# EAGLE design M7050C (EAGLE 6.6.0)
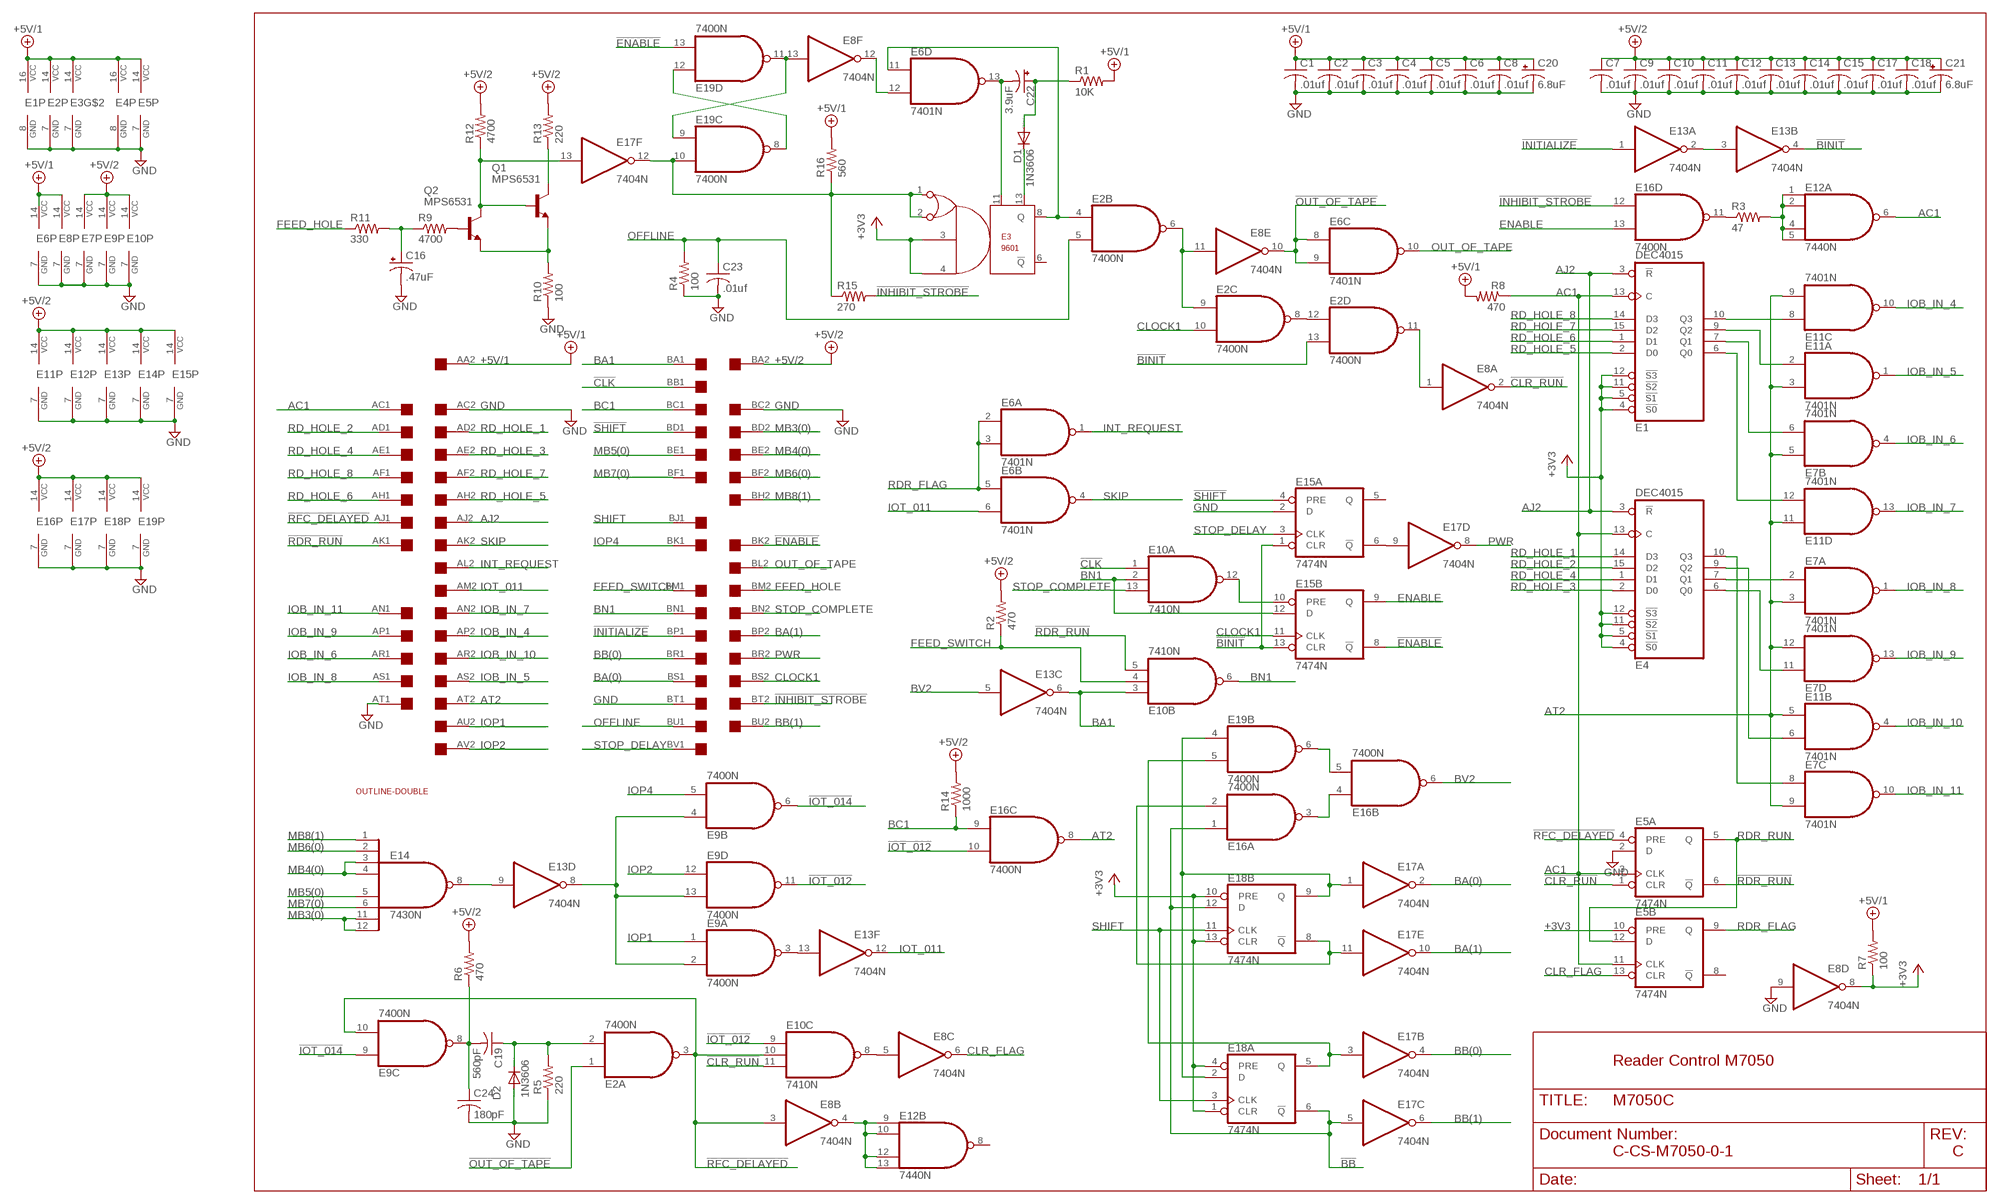
[diagram p0: schematic, sheet 1]

## Parts
C1  .01uf  C-US075-032X103  [C075-032X103]
C2  .01uf  C-US075-032X103  [C075-032X103]
C3  .01uf  C-US075-032X103  [C075-032X103]
C4  .01uf  C-US075-032X103  [C075-032X103]
C5  .01uf  C-US075-032X103  [C075-032X103]
C6  .01uf  C-US075-032X103  [C075-032X103]
C7  .01uf  C-US075-032X103  [C075-032X103]
C8  .01uf  C-US075-032X103  [C075-032X103]
C9  .01uf  C-US075-032X103  [C075-032X103]
C10  .01uf  C-US075-032X103  [C075-032X103]
C11  .01uf  C-US075-032X103  [C075-032X103]
C12  .01uf  C-US075-032X103  [C075-032X103]
C13  .01uf  C-US075-032X103  [C075-032X103]
C14  .01uf  C-US075-032X103  [C075-032X103]
C15  .01uf  C-US075-032X103  [C075-032X103]
C16  .47uF  CPOL-USE15-5AXIAL  [E15-5]
C17  .01uf  C-US075-032X103  [C075-032X103]
C18  .01uf  C-US075-032X103  [C075-032X103]
C19  560pF  C-US075-032X103  [C075-032X103]
C20  6.8uF  CPOL-USE20-8AXIAL  [E12-8]
C21  6.8uF  CPOL-USE20-8AXIAL  [E12-8]
C22  3.9uF  CPOL-USE15-5AXIAL  [E15-5]
C23  .01uf  C-US075-032X103  [C075-032X103]
C24  180pF  C-US075-032X103  [C075-032X103]
D1  1N3606  1N4148DO35-10  [DO35-10]
D2  1N3606  1N4148DO35-10  [DO35-10]
E1  DEC4015  [DIL16]
E2  7400N  [DIL14]
E3  9601  [DIL14]
E4  DEC4015  [DIL16]
E5  7474N  74S74N  [DIL14]
E6  7401N  74LS01N  [DIL14]
E7  7401N  74LS01N  [DIL14]
E8  7404N  [DIL14]
E9  7400N  [DIL14]
E10  7410N  [DIL14]
E11  7401N  74LS01N  [DIL14]
E12  7440N  74S20N  [DIL14]
E13  7404N  [DIL14]
E14  7430N  [DIL14]
E15  7474N  74S74N  [DIL14]
E16  7400N  [DIL14]
E17  7404N  [DIL14]
E18  7474N  74S74N  [DIL14]
E19  7400N  [DIL14]
Q1  MPS6531  2N2102  [TO5]
Q2  MPS6531  2N2102  [TO5]
R1  10K  R-US_0207/10  [0207/10]
R2  470  R-US_0207/10  [0207/10]
R3  47  R-US_0207/10  [0207/10]
R4  100  R-US_0207/10  [0207/10]
R5  220  R-US_0207/10  [0207/10]
R6  470  R-US_0207/10  [0207/10]
R7  100  R-US_0207/10  [0207/10]
R8  470  R-US_0207/10  [0207/10]
R9  4700  R-US_0207/10  [0207/10]
R10  100  R-US_0207/10  [0207/10]
R11  330  R-US_0207/10  [0207/10]
R12  4700  R-US_0207/10  [0207/10]
R13  220  R-US_0207/10  [0207/10]
R14  1000  R-US_0207/10  [0207/10]
R15  270  R-US_0207/10  [0207/10]
R16  560  R-US_0207/10  [0207/10]
U$5  DOUBLE  [EDGE-CON4]
U$6  OUTLINE-DOUBLE  [DOUBLE]

## Nets
!BA: E16.2(A:I1) E17.11(E:I) E18.8(B:!Q)
!BB: E16.1(A:I0) E17.5(C:I) E18.6(A:!Q) E18.12(B:D)
!BINIT: E2.13(D:I1) E13.4(B:O) E15.1(A:CLR) E15.13(B:CLR)
!CLK: E10.1(A:I0) U$5.BB1
!CLR_RUN: E5.1(A:CLR) E8.2(A:O) E10.11(C:I2)
!ENABLE: E15.8(B:!Q) E19.13(D:I1) U$5.BK2
!INHIBIT_STROBE: E16.12(D:I0) R15.2 U$5.BT2
!INITIALIZE: E13.1(A:I) U$5.BP1
!IOT_011: E9.3(A:O) E13.13(F:I)
!IOT_012: E9.11(D:O) E10.9(C:I0) E16.10(C:I1)
!IOT_014: E9.6(B:O) E9.9(C:I0)
!OUT_OF_TAPE: E2.1(A:I0) E6.8(C:I0) E6.9(C:I1) E8.10(E:O)
!RDR_RUN: E5.6(A:!Q) E10.5(B:I2) U$5.AK1
!RFC_DELAYED: E2.3(A:O) E5.4(A:PRE) E8.3(B:I) E9.10(C:I1) E10.10(C:I1) U$5.AJ1
!SHIFT: E15.4(A:PRE) U$5.BD1
+3V3: E1.4(!S0) E1.5(!S1) E1.11(!S2) E1.12(!S3) E3.3 E3.4 E4.4(!S0) E4.5(!S1) E4.11(!S2) E4.12(!S3) E5.10(B:PRE) E8.8(D:O) E18.1(A:CLR) E18.4(A:PRE) E18.10(B:PRE) E18.13(B:CLR) R7.1
+5V/1 [Supply]: C1.1 C2.1 C3.1 C4.1 C5.1 C6.1 C8.1 C20.+ E1.16(VCC) E2.14(P:VCC) E3.14(VCC) E4.16(VCC) E5.14(P:VCC) E6.14(P:VCC) E8.14(P:VCC) R1.2 R7.2 R8.2 R16.2 U$5.AA2
+5V/2 [Supply]: C7.1 C9.1 C10.1 C11.1 C12.1 C13.1 C14.1 C15.1 C17.1 C18.1 C21.+ E7.14(P:VCC) E9.14(P:VCC) E10.14(P:VCC) E11.14(P:VCC) E12.14(P:VCC) E13.14(P:VCC) E14.14(VCC) E15.14(P:VCC) E16.14(P:VCC) E17.14(P:VCC) E18.14(P:VCC) E19.14(P:VCC) R2.2 R6.2 R12.2 R13.2 R14.2 U$5.BA2
AC1: E1.13(C) E4.13(C) E5.3(A:CLK) E5.11(B:CLK) E12.6(A:O) R8.1 U$5.AC1
AJ2: E1.3(!R) E4.3(!R) U$5.AJ2
AT2: E7.3(A:I1) E7.5(B:I0) E7.9(C:I1) E7.12(D:I1) E11.3(A:I1) E11.5(B:I0) E11.9(C:I1) E11.11(D:I0) E16.8(C:O) U$5.AT2
BA: E17.1(A:I) E18.2(A:D) E18.9(B:Q) E19.4(B:I0)
BA1: E10.3(B:I0) E13.6(C:O) U$5.BA1
BA(0): E17.2(A:O) U$5.BS1
BA(1): E17.10(E:O) U$5.BP2
BB: E17.3(B:I) E18.5(A:Q) E19.5(B:I1)
BB(0): E17.4(B:O) U$5.BR1
BB(1): E17.6(C:O) U$5.BU2
BC1: E16.9(C:I0) R14.1 U$5.BC1
BN1: E10.2(A:I1) E10.6(B:O) E15.12(B:D) U$5.BN1
BV2: E13.5(C:I) E16.6(B:O)
CLOCK1: E2.10(C:I1) E15.11(B:CLK) U$5.BS2
CLR_FLAG: E5.13(B:CLR) E8.6(C:O)
ENABLE: E15.9(B:Q) E16.13(D:I1)
FEED_HOLE: R11.1 U$5.BM2
FEED_SWITCH: E10.4(B:I1) R2.1 U$5.BM1
GND [Supply]: C1.2 C2.2 C3.2 C4.2 C5.2 C6.2 C7.2 C8.2 C9.2 C10.2 C11.2 C12.2 C13.2 C14.2 C15.2 C16.- C17.2 C18.2 C20.- C21.- C23.2 C24.2 D2.A E1.8(GND) E2.7(P:GND) E3.7(GND) E4.8(GND) E5.2(A:D) E5.7(P:GND) E6.7(P:GND) E7.7(P:GND) E8.7(P:GND) E8.9(D:I) E9.7(P:GND) E10.7(P:GND) E11.7(P:GND) E12.7(P:GND) E13.7(P:GND) E14.7(GND) E15.2(A:D) E15.7(P:GND) E16.7(P:GND) E17.7(P:GND) E18.7(P:GND) E19.7(P:GND) R4.1 R5.1 R10.1 U$5.AC2 U$5.AT1 U$5.BC2 U$5.BT1
INT_REQUEST: E6.1(A:O) U$5.AL2
IOB_IN_4: E11.10(C:O) U$5.AP2
IOB_IN_5: E11.1(A:O) U$5.AS2
IOB_IN_6: E7.4(B:O) U$5.AR1
IOB_IN_7: E11.13(D:O) U$5.AN2
IOB_IN_8: E7.1(A:O) U$5.AS1
IOB_IN_9: E7.13(D:O) U$5.AP1
IOB_IN_10: E11.4(B:O) U$5.AR2
IOB_IN_11: E7.10(C:O) U$5.AN1
IOP1: E9.1(A:I0) U$5.AU2
IOP2: E9.12(D:I0) U$5.AV2
IOP4: E9.5(B:I1) U$5.BK1
IOT_011: E6.6(B:I1) E13.12(F:O) U$5.AM2
MB3(0): E14.11(I6) E14.12(I7) U$5.BD2
MB4(0): E14.3(I2) E14.4(I3) U$5.BE2
MB5(0): E14.5(I4) U$5.BE1
MB6(0): E14.2(I1) U$5.BF2
MB7(0): E14.6(I5) U$5.BF1
MB8(1): E14.1(I0) U$5.BH2
N$1: D1.C E3.13
N$2: E1.10(Q3) E11.8(C:I0)
N$3: E1.9(Q2) E11.2(A:I0)
N$4: C22.+ D1.A R1.1
N$5: E13.9(D:I) E14.8(O)
N$6: E2.11(D:O) E8.1(A:I)
N$8: E9.2(A:I1) E9.4(B:I0) E9.13(D:I1) E13.8(D:O)
N$9: E1.7(Q1) E7.6(B:I1)
N$10: E1.6(Q0) E11.12(D:I1)
N$11: E4.7(Q1) E7.2(A:I0)
N$12: E4.6(Q0) E7.11(D:I0)
N$13: E4.9(Q2) E11.6(B:I1)
N$14: E4.10(Q3) E7.8(C:I0)
N$16: E2.8(C:O) E2.12(D:I0)
N$17: E17.13(F:I) Q1.2(B) Q2.3(C) R12.1
N$18: Q1.3(C) R13.1
N$19: Q1.1(E) Q2.1(E) R10.2
N$20: Q2.2(B) R9.2
N$21: E3.1 E3.2 E17.12(F:O) E19.10(C:I1) R15.1 R16.1
N$22: C16.+ R9.1 R11.2
N$24: E16.5(B:I1) E19.6(B:O)
N$25: E16.3(A:O) E16.4(B:I0)
N$26: E16.11(D:O) R3.1
N$27: E15.6(A:!Q) E17.9(D:I)
N$28: E10.12(A:O) E15.10(B:PRE)
N$29: C19.2 C24.1 E9.8(C:O) R6.1
N$30: C19.1 D2.C E2.2(A:I1) R5.2
N$32: E13.2(A:O) E13.3(B:I)
N$33: E8.5(C:I) E10.8(C:O)
N$34: E2.4(B:I0) E3.8(Q) E6.11(D:I0)
N$35: E2.6(B:O) E2.9(C:I0) E8.11(E:I)
N$36: E8.4(B:O) E12.9(B:I0) E12.10(B:I1) E12.12(B:I2) E12.13(B:I3)
N$37: C22.- E3.11 E6.13(D:O)
N$38: E6.12(D:I1) E8.12(F:O)
N$39: E12.1(A:I0) E12.2(A:I1) E12.4(A:I2) E12.5(A:I3) R3.2
N$40: E8.13(F:I) E19.9(C:I0) E19.11(D:O)
N$41: E19.8(C:O) E19.12(D:I0)
OFFLINE: C23.1 E2.5(B:I1) R4.2 U$5.BU1
OUT_OF_TAPE: E6.10(C:O) U$5.BL2
PWR: E17.8(D:O) U$5.BR2
RD_HOLE_1: E4.14(D3) U$5.AD2
RD_HOLE_2: E4.15(D2) U$5.AD1
RD_HOLE_3: E4.2(D0) U$5.AE2
RD_HOLE_4: E4.1(D1) U$5.AE1
RD_HOLE_5: E1.2(D0) U$5.AH2
RD_HOLE_6: E1.1(D1) U$5.AH1
RD_HOLE_7: E1.15(D2) U$5.AF2
RD_HOLE_8: E1.14(D3) U$5.AF1
RDR_FLAG: E5.9(B:Q) E6.2(A:I0) E6.3(A:I1) E6.5(B:I0)
RDR_RUN: E5.5(A:Q) E5.12(B:D)
SHIFT: E18.3(A:CLK) E18.11(B:CLK) U$5.BJ1
SKIP: E6.4(B:O) U$5.AK2
STOP_COMPLETE: E10.13(A:I2) U$5.BN2
STOP_DELAY: E15.3(A:CLK) U$5.BV1
Unconnected: E3.6(!Q) E5.8(B:!Q) E12.8(B:O) E13.10(E:O) E13.11(E:I) E15.5(A:Q) E19.1(A:I0) E19.2(A:I1) E19.3(A:O) U$5.AA1 U$5.AB1 U$5.AB2 U$5.AL1 U$5.AM1 U$5.AU1 U$5.AV1 U$5.BB2 U$5.BH1 U$5.BJ2 U$5.BL1 U$5.BV2

## Notes on the sheet
- Reader Control M7050
- C-CS-M7050-0-1 | C

## Library data of the parts
C1-C15 C17-C19 C23 C24 = rcl:C-US: CAPACITOR, American symbol
C16 = dec-con:CPOL-USE15-5AXIAL: 0.5" veresion of an electrolytic
C20 C21 = dec-con:CPOL-USE20-8AXIAL: A 0.8 inch electrolytic.
C22 = rcl:CPOL-US: POLARIZED CAPACITOR, American symbol
D1 D2 = diode:1N4148: DIODE high speed (Philips)
E1 E4 = dec-con:DEC4015: Quad latch, used in early DEC boards.
E2 E9 E16 E19 = 74xx-us:74*00: Quad 2-input NAND gate
E3 = dec-con:9601: DEC9601 monstable
E5 E15 E18 = 74xx-us:74*74: Dual D type positive edge triggered FLIP FLOP, preset and clear
E6 E7 E11 = 74xx-us:74*01: Quad 2-input NAND gate, open collector
E8 E13 E17 = 74xx-us:74*04: Hex INVERTER
E10 = 74xx-us:74*10: Triple 3-input NAND gate
E12 = 74xx-us:74*20: Dual 4-input NAND gate
E14 = 74xx-us:74*30: 8-input NAND gate
Q1 Q2 = transistor-npn:2N2102: NPN Transistor
R1-R16 = rcl:R-US_: RESISTOR, American symbol
U$5 = dec-con:DOUBLE: Double-Height DEC board
U$6 = dec-con:OUTLINE-*: Board outlines for DEC boards.

## Net classes
1 Supply: width 0.813 mm

## Board
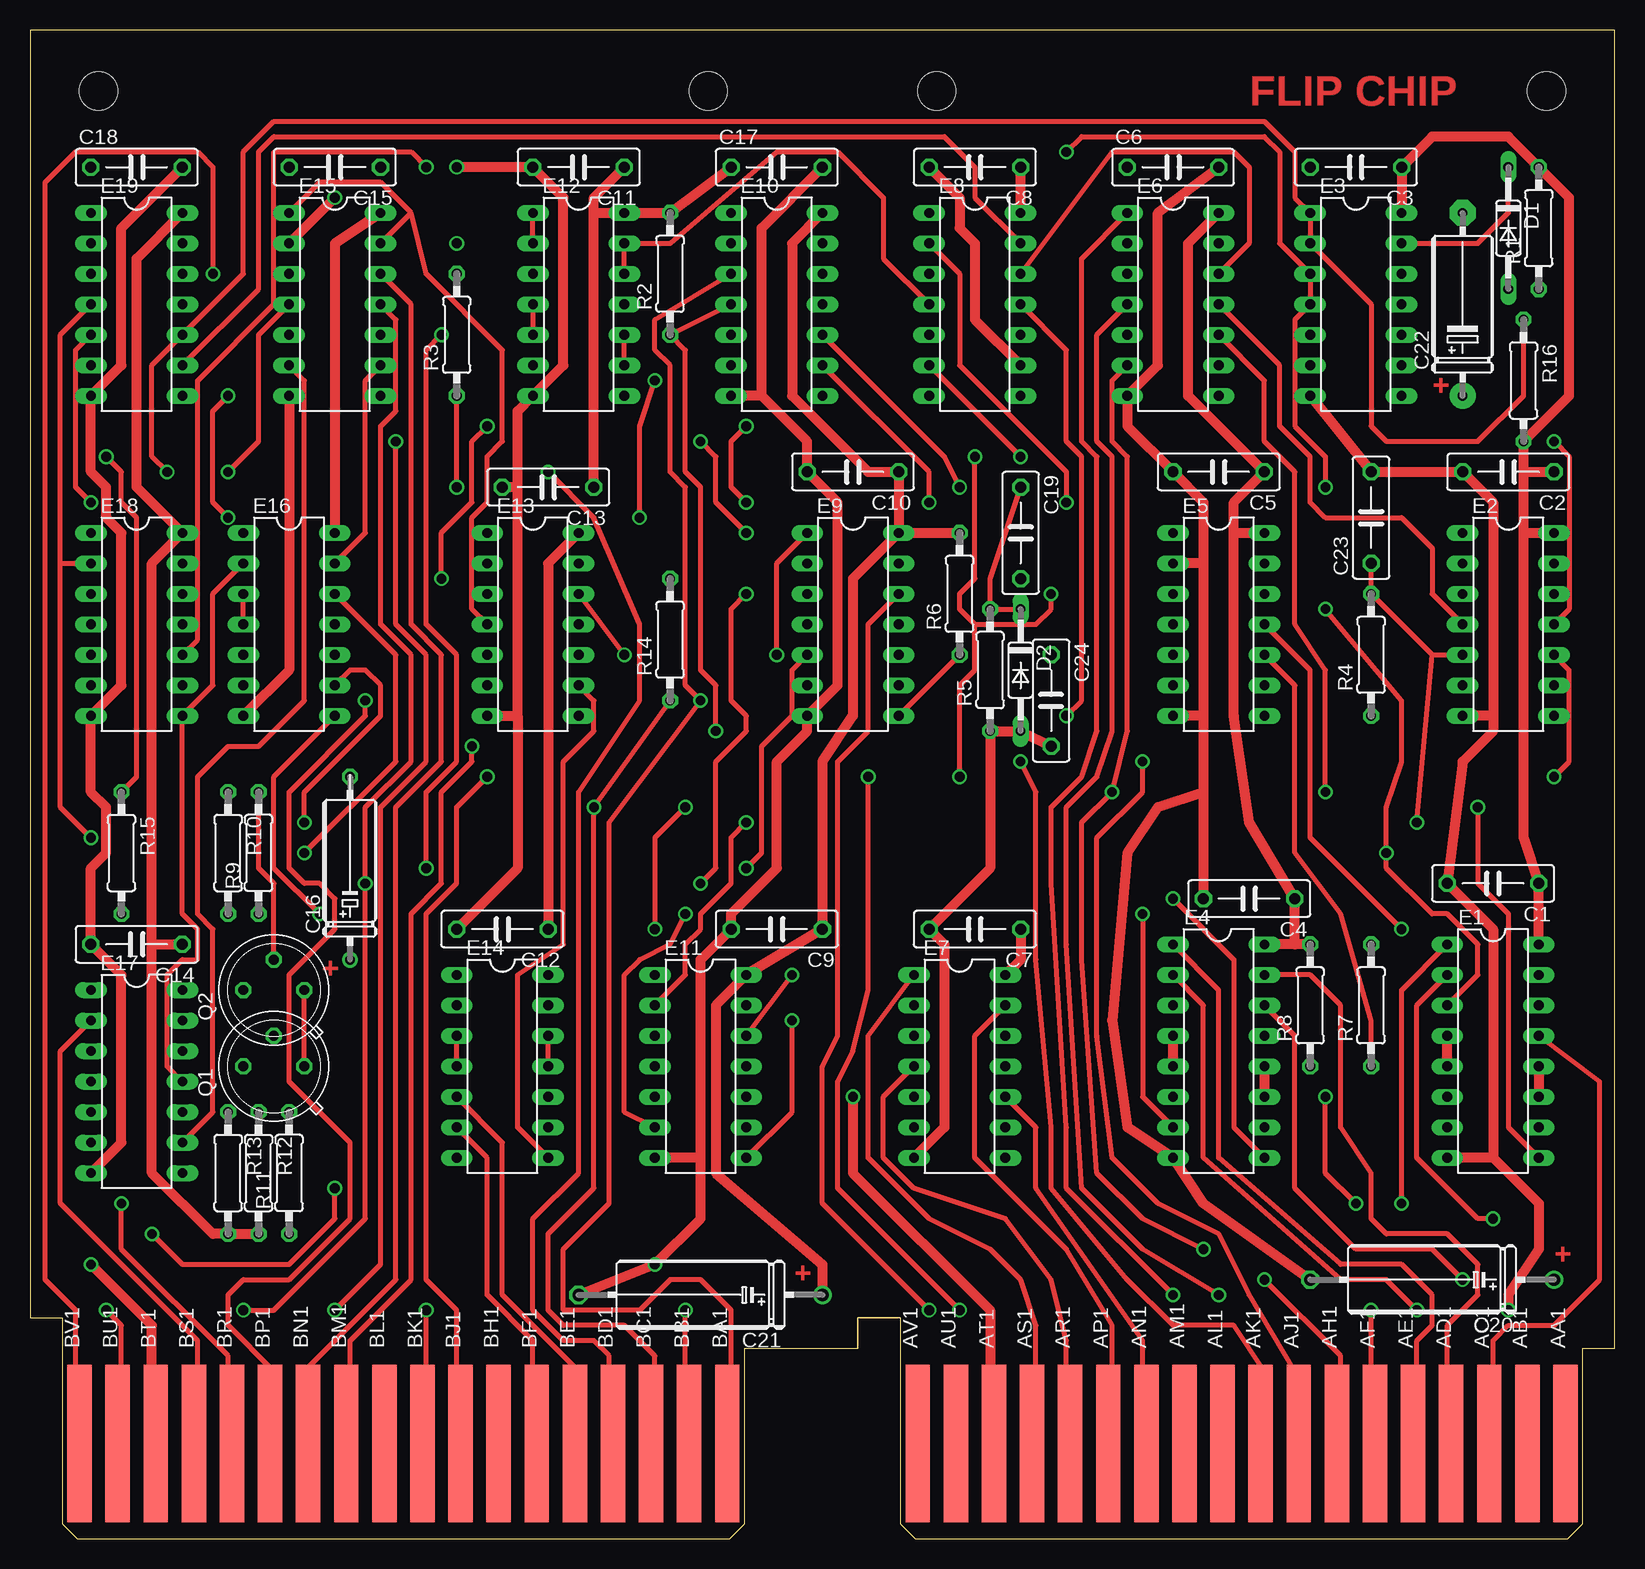
[diagram p1: board, top side]
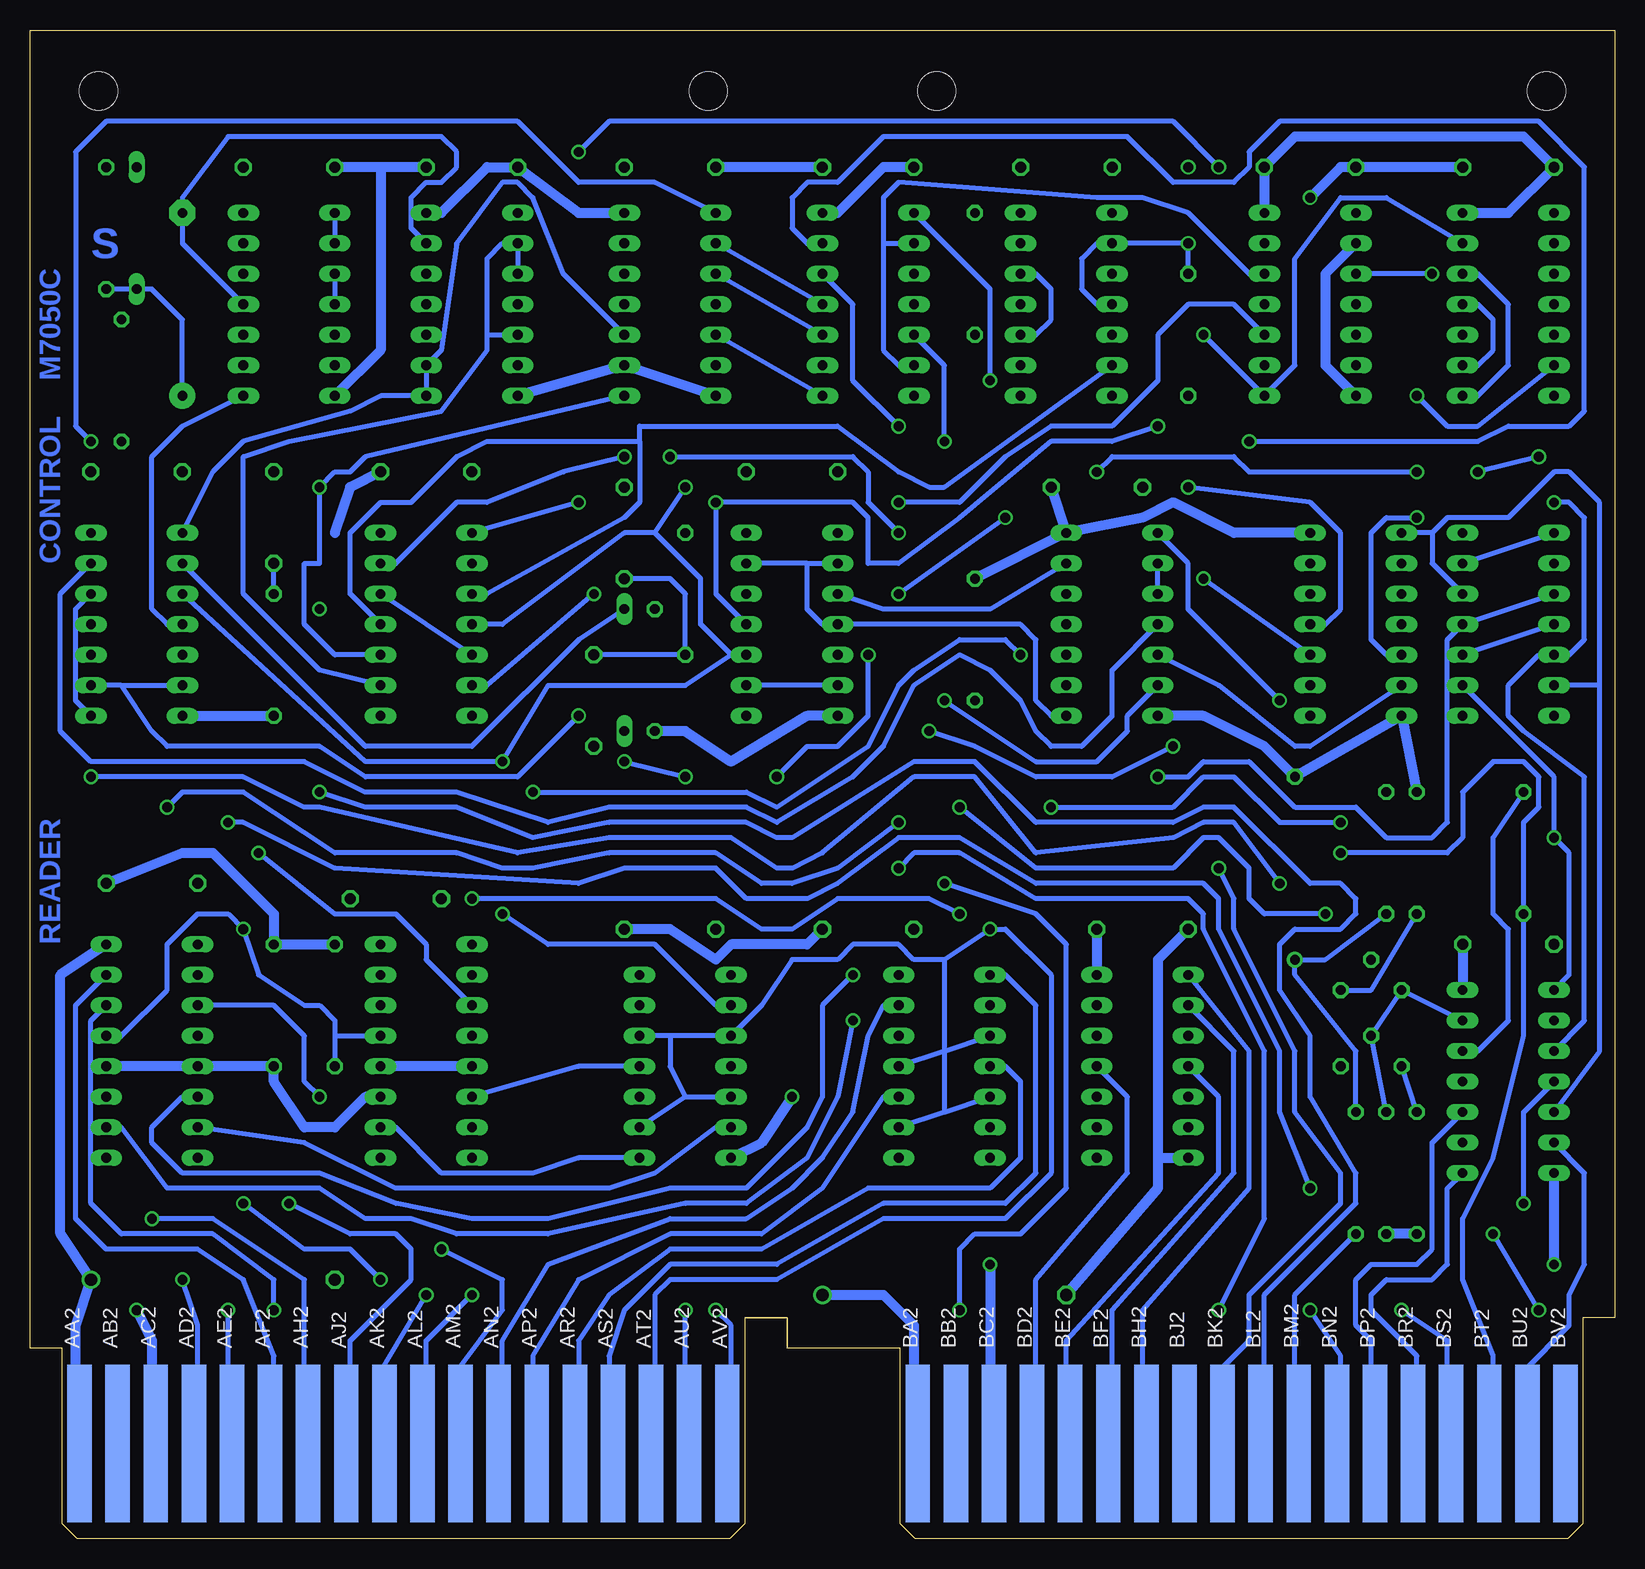
[diagram p2: board, bottom side, seen from below]

Size 132.08 x 125.73 mm. Coordinates in mm from the lower left corner, seen from the top.
Copper layers (1+16): Top 0.035mm / dielectric 1.5mm / Bottom 0.035mm
Design rules "16mils": minimum track width 16mil, minimum drill 32mil, track to track 15mil, track to pad 10mil, pad to pad 10mil, via to via 10mil, smd to smd 10mil, copper to edge 13mil, drill to drill 10mil, minimum pad ring 10mil, minimum via ring 8mil, stop-mask expansion 0mil, vias tented up to drill 0mil, thermal gap 10mil

### Footprints (pad centres in the part's own frame; a part is rotated, then mirrored left to right if it is on the bottom)
C075-032X103 = drill 0.914 octagon: 1 -3.81,0; 2 3.81,0
E15-5 = drill 0.813: + -7.62,0 | drill 0.813 octagon: - 7.62,0
E12-8 = drill 1.016: + -10.16,0 | drill 1.016 octagon: - 10.16,0
E15-5' = drill 0.813 pad 2.159: + -7.62,0 | drill 0.813 pad 2.159 octagon: - 7.62,0
DO35-10 = drill 0.813 long: A 5.08,0; C -5.08,0
DIL16 = drill 0.813 long: 1 -8.89,-3.81; 2 -6.35,-3.81; 3 -3.81,-3.81; 4 -1.27,-3.81; 5 1.27,-3.81; 6 3.81,-3.81; 7 6.35,-3.81; 8 8.89,-3.81; 9 8.89,3.81; 10 6.35,3.81; 11 3.81,3.81; 12 1.27,3.81; 13 -1.27,3.81; 14 -3.81,3.81; 15 -6.35,3.81; 16 -8.89,3.81
DIL14 = drill 0.813 long: 1 -7.62,-3.81; 2 -5.08,-3.81; 3 -2.54,-3.81; 4 0,-3.81; 5 2.54,-3.81; 6 5.08,-3.81; 7 7.62,-3.81; 8 7.62,3.81; 9 5.08,3.81; 10 2.54,3.81; 11 0,3.81; 12 -2.54,3.81; 13 -5.08,3.81; 14 -7.62,3.81
TO5 = drill 0.813 octagon: 1 0,-2.54; 2 2.54,0; 3 0,2.54
0207/10 = drill 0.813 octagon: 1 -5.08,0; 2 5.08,0
EDGE-CON4 = smd 13.106 x 2.032: AA1 7.938,4.128; AB1 7.938,7.303; AC1 7.938,10.477; AD1 7.938,13.652; AE1 7.938,16.828; AF1 7.938,20.003; AH1 7.938,23.177; AJ1 7.938,26.352; AK1 7.938,29.527; AL1 7.938,32.703; AM1 7.938,35.877; AN1 7.938,39.053; AP1 7.938,42.227; AR1 7.938,45.403; AS1 7.938,48.578; AT1 7.938,51.752; AU1 7.938,54.928; AV1 7.938,58.102; BA1 7.938,73.978; BB1 7.938,77.153; BC1 7.938,80.328; BD1 7.938,83.502; BE1 7.938,86.677; BF1 7.938,89.853; BH1 7.938,93.028; BJ1 7.938,96.203; BK1 7.938,99.377; BL1 7.938,102.552; BM1 7.938,105.728; BN1 7.938,108.903; BP1 7.938,112.078; BR1 7.938,115.252; BS1 7.938,118.427; BT1 7.938,121.603; BU1 7.938,124.778; BV1 7.938,127.953 | smd 13.106 x 2.032 bottom: AA2 7.938,4.128; AB2 7.938,7.303; AC2 7.938,10.477; AD2 7.938,13.652; AE2 7.938,16.828; AF2 7.938,20.003; AH2 7.938,23.177; AJ2 7.938,26.352; AK2 7.938,29.527; AL2 7.938,32.703; AM2 7.938,35.877; AN2 7.938,39.053; AP2 7.938,42.227; AR2 7.938,45.403; AS2 7.938,48.578; AT2 7.938,51.752; AU2 7.938,54.928; AV2 7.938,58.102; BA2 7.938,73.978; BB2 7.938,77.153; BC2 7.938,80.328; BD2 7.938,83.502; BE2 7.938,86.677; BF2 7.938,89.853; BH2 7.938,93.028; BJ2 7.938,96.203; BK2 7.938,99.377; BL2 7.938,102.552; BM2 7.938,105.728; BN2 7.938,108.903; BP2 7.938,112.078; BR2 7.938,115.252; BS2 7.938,118.427; BT2 7.938,121.603; BU2 7.938,124.778; BV2 7.938,127.953
DOUBLE = hole 3.175: 120.65,56.515; 120.65,5.715; 120.65,75.565; 120.65,126.365

### Placement (x,y rotation side)
C1  121.92,54.61 180 top
C2  123.19,88.9 180 top
C3  110.49,114.3 180 top
C4  101.6,53.34 180 top
C5  99.06,88.9 180 top
C6  95.25,114.3 0 top
C7  78.74,50.8 180 top
C8  78.74,114.3 180 top
C9  62.23,50.8 180 top
C10  68.58,88.9 180 top
C11  45.72,114.3 180 top
C12  39.37,50.8 180 top
C13  43.18,87.63 180 top
C14  8.89,49.53 180 top
C15  25.4,114.3 180 top
C16  26.67,55.88 90 top
C17  62.23,114.3 0 top
C18  8.89,114.3 0 top
C19  82.55,83.82 270 top
C20  116.84,21.59 180 top
C21  55.88,20.32 180 top
C22  3.9uF  [E15-5']  119.38,102.87 90 top
C23  111.76,85.09 90 top
C24  85.09,69.85 270 top
D1  123.19,109.22 270 top
D2  82.55,72.39 270 top
E1  121.92,40.64 270 top
E2  123.19,76.2 270 top
E3  110.49,102.87 270 top
E4  99.06,40.64 270 top
E5  99.06,76.2 270 top
E6  95.25,102.87 270 top
E7  77.47,39.37 270 top
E8  78.74,102.87 270 top
E9  68.58,76.2 270 top
E10  62.23,102.87 270 top
E11  55.88,39.37 270 top
E12  45.72,102.87 270 top
E13  41.91,76.2 270 top
E14  39.37,39.37 270 top
E15  25.4,102.87 270 top
E16  21.59,76.2 270 top
E17  8.89,38.1 270 top
E18  8.89,76.2 270 top
E19  8.89,102.87 270 top
Q1  20.32,39.37 90 top
Q2  20.32,45.72 90 top
R1  125.73,109.22 90 top
R2  53.34,105.41 90 top
R3  35.56,100.33 90 top
R4  111.76,73.66 90 top
R5  80.01,72.39 90 top
R6  77.47,78.74 90 top
R7  111.76,44.45 90 top
R8  106.68,44.45 90 top
R9  19.05,57.15 90 top
R10  16.51,57.15 270 top
R11  21.59,30.48 90 top
R12  19.05,30.48 270 top
R13  16.51,30.48 270 top
R14  53.34,74.93 90 top
R15  7.62,57.15 270 top
R16  124.46,96.52 270 top
U$3  [FLIPCHIP]  82.55,124.46 270 top
U$5  132.08,0 90 top
U$6  132.08,0 90 top

### Tracks (layer width: path | path; a pad name or v marks a point on that pad's centre or on a via)
!BA
  Top 0.406: E17.11 11.43,39.37 11.43,46.99 12.7,48.26 13.97,48.26 13.97,50.8 12.7,52.07 E18.8 15.24,71.12 15.24,78.74 E16.2
!BB
  Bottom 0.406: E17.5 1.27,40.64 1.27,71.12 | 1.27,71.12 E18.6 | 15.24,83.82 E16.1 | 15.24,83.82 13.97,85.09 8.89,85.09 5.08,88.9 3.81,88.9 1.27,86.36 1.27,71.12 | E18.12 15.24,81.28 15.24,83.82
!BINIT
  Top 0.406: E15.1 24.13,113.03 29.21,113.03 31.75,110.49 | 31.75,110.49 E15.13 | E13.4 36.83,77.47 36.83,85.09 38.1,86.36 38.1,90.17 39.37,91.44 39.37,99.06 33.02,105.41 31.75,110.49
  Bottom 0.406: E2.13 129.54,78.74 129.54,67.31 127,64.77 109.22,64.77 104.14,62.23 96.52,62.23 88.9,59.69 83.82,60.96 72.39,60.96 69.85,59.69 63.5,63.5 60.96,66.04 58.42,71.12 54.61,73.66 52.07,72.39 49.53,69.85 48.26,67.31 46.99,66.04 44.45,66.04 41.91,68.58 41.91,72.39 E13.4
!CLK  (via drill 0.81)
  Top 0.406: U$5.BB1 54.61,8.89 v54.61,19.05 | v55.88,54.61 57.15,55.88 57.15,64.77 59.69,67.31 59.69,68.58 58.42,69.85 58.42,77.47 v59.69,78.74 | v50.8,85.09 50.8,92.71 v52.07,96.52
  Bottom 0.406: E10.1 52.07,104.14 v52.07,96.52 | v54.61,19.05 54.61,24.13 53.34,25.4 49.53,25.4 45.72,29.21 45.72,49.53 48.26,52.07 v55.88,54.61 | v59.69,78.74 v50.8,85.09
!CLR_RUN  (via drill 0.81)
  Top 0.406: v86.36,86.36 86.36,88.9 77.47,97.79 77.47,105.41 E8.2
  Bottom 0.406: E10.11 E8.2 | v86.36,86.36 E5.1
!ENABLE  (via drill 0.81)
  Top 0.406: v34.29,100.33 33.02,99.06 33.02,76.2 35.56,73.66 35.56,64.77 33.02,62.23 v33.02,55.88
  Bottom 0.406: v34.29,100.33 E15.8 26.67,97.79 26.67,106.68 22.86,111.76 19.05,111.76 E19.13 | v33.02,55.88 31.75,53.34 31.75,50.8 26.67,40.64 26.67,35.56 22.86,30.48 22.86,27.94 30.48,20.32 30.48,16.51 33.02,13.97 33.02,8.89 U$5.BK2
!INHIBIT_STROBE  (via drill 0.81)
  Top 0.406: E16.12 30.48,73.66 30.48,64.77 v22.86,57.15
  Bottom 0.406: U$5.BT2 10.16,8.89 10.16,15.24 12.7,21.59 12.7,26.67 10.16,31.75 7.62,41.91 R15.2 7.62,59.69 6.35,60.96 6.35,63.5 7.62,64.77 10.16,64.77 12.7,62.23 12.7,58.42 13.97,57.15 v22.86,57.15
!INITIALIZE  (via drill 0.81)
  Top 0.406: v27.94,69.85 27.94,68.58 21.59,62.23 21.59,55.88 22.86,54.61 24.13,54.61 25.4,53.34 25.4,50.8 21.59,46.99 21.59,38.1 26.67,33.02 26.67,26.67 21.59,21.59 17.78,21.59 16.51,20.32 16.51,17.78 20.32,13.97 20.32,8.89 U$5.BP1
  Bottom 0.406: E13.1 35.56,81.28 35.56,77.47 v27.94,69.85
!IOT_011
  Bottom 0.406: E13.13 52.07,77.47 60.96,77.47 E9.3
!IOT_012  (via drill 0.81)
  Top 0.406: v34.29,80.01 34.29,83.82 36.83,86.36 36.83,91.44 v38.1,92.71 | E10.9 74.93,88.9 v74.93,86.36
  Bottom 0.406: E16.10 v34.29,80.01 | v38.1,92.71 41.91,91.44 46.99,91.44 54.61,85.09 59.69,81.28 62.23,81.28 62.23,85.09 63.5,86.36 v74.93,86.36 74.93,78.74 E9.11
!IOT_014
  Bottom 0.406: E9.6 E9.9
!OUT_OF_TAPE
  Bottom 0.406: E8.10 87.63,105.41 90.17,111.76 91.44,113.03 92.71,113.03 96.52,107.95 97.79,99.06 E6.9 E6.8 102.87,95.25 105.41,93.98 114.3,91.44 116.84,88.9 E2.1
!RDR_RUN  (via drill 0.81)
  Top 0.406: U$5.AK1 102.87,8.89 102.87,13.97 100.33,17.78 95.25,17.78 91.44,21.59 85.09,29.21 85.09,34.29 83.82,48.26 83.82,62.23 v82.55,64.77 | v55.88,91.44 57.15,90.17 57.15,86.36 v59.69,83.82 | v85.09,78.74 85.09,77.47 83.82,76.2 78.74,76.2 | 78.74,76.2 77.47,77.47 77.47,78.74 78.74,80.01 v78.74,90.17 | 78.74,76.2 78.74,72.39 77.47,71.12 v77.47,63.5
  Bottom 0.406: v82.55,64.77 v77.47,63.5 | E10.5 55.88,97.79 v55.88,91.44 | E5.6 93.98,71.12 v85.09,78.74 | v59.69,83.82 62.23,86.36 62.23,88.9 63.5,90.17 v78.74,90.17
!RFC_DELAYED  (via drill 0.81)
  Top 0.406: U$5.AJ1 105.41,8.89 105.41,13.97 101.6,20.32 99.06,25.4 93.98,27.94 90.17,31.75 88.9,41.91 88.9,58.42 92.71,62.23 v92.71,64.77 | E10.10 76.2,90.17 v77.47,87.63
  Bottom 0.406: E10.10 E8.3 | 73.66,73.66 E9.10 | 73.66,73.66 77.47,71.12 88.9,71.12 v92.71,64.77 104.14,64.77 E2.3 | E5.4 92.71,76.2 82.55,83.82 80.01,83.82 | 80.01,83.82 v77.47,87.63 | 80.01,83.82 76.2,80.01 76.2,76.2 73.66,73.66
!SHIFT  (via drill 0.81)
  Top 0.406: U$5.BD1 48.56,8.59 48.26,8.89 48.26,15.24 46.99,16.51 44.45,16.51 41.91,19.05 41.91,26.67 45.72,30.48 45.72,62.23 50.8,69.85 50.8,76.2 46.99,85.09 v43.18,88.9 | E15.4 19.05,100.33 19.05,91.44 v16.51,88.9
  Bottom 0.406: v43.18,88.9 41.91,90.17 31.75,90.17 30.48,88.9 v16.51,88.9
+3V3  (via drill 0.81)
  Top 0.406: E18.10 13.97,74.93 13.97,81.28 | 13.97,81.28 E18.13 | 13.97,81.28 13.97,96.52 20.32,102.87 20.32,115.57 31.75,115.57 v33.02,114.3 | v86.36,115.57 87.63,116.84 102.87,116.84 104.14,115.57 104.14,107.95 E3.3 E3.4 105.41,101.6 105.41,92.71 107.95,90.17 v107.95,87.63 | E5.10 105.41,71.12 105.41,57.15 109.22,52.07 111.76,43.18 R7.1
  Top 0.813: E1.5 E1.4 | E1.12 E1.11 | E4.5 E4.4 | E4.12 E4.11
  Bottom 0.406: E18.4 E18.10 | E18.13 E18.1 | E3.3 E3.4 | v33.02,114.3 36.83,118.11 83.82,118.11 v86.36,115.57 | E5.10 106.68,73.66 109.22,76.2 109.22,81.28 107.95,81.28 v107.95,87.63 106.68,88.9 105.41,88.9 104.14,90.17 E8.8
  Bottom 0.813: E1.12 E1.5 R7.1 111.76,38.1 109.22,34.29 106.68,34.29 104.14,36.83 E4.11 | E4.5 E4.12
+5V/1
  Top 0.813: 124.46,88.9 R16.2 128.27,95.25 128.27,111.76 R1.2 123.19,116.84 116.84,116.84 C3.1 E3.14 | 124.46,88.9 C2.1 | 124.46,83.82 124.46,88.9 | 124.46,83.82 124.46,58.42 C1.1 E1.16 | 124.46,83.82 E2.14 | 100.33,83.82 100.33,86.36 C5.1 96.52,95.25 96.52,107.95 E6.14 | 100.33,83.82 E5.14 | 100.33,83.82 100.33,68.58 101.6,59.69 C4.1 105.41,49.53 | E8.14 C8.1 | R8.2 105.41,49.53 | 105.41,49.53 E4.16
  Bottom 0.813: E6.14 97.79,110.49 93.98,114.3 C6.1 86.36,110.49 E8.14 | U$5.AA2 127.87,8.49 128.27,8.89 128.27,17.78 C20.+ 129.54,25.4 129.54,46.99 E1.16 | R8.2 R7.2 111.76,52.07 116.84,57.15 119.38,57.15 C1.1 | 106.68,83.82 105.41,87.63 C5.1
+5V/2
  Top 0.813: E19.14 8.89,106.68 8.89,87.63 E18.14 10.16,81.28 10.16,49.53 | E16.14 25.4,107.95 E15.14 | R12.2 R13.2 15.24,25.4 10.16,30.48 10.16,49.53 | 10.16,49.53 C14.1 | C17.1 R2.2 E12.14 46.99,110.49 | C11.1 46.99,111.76 46.99,110.49 | C13.1 46.99,110.49 | C21.+ 66.04,22.86 57.15,30.48 57.15,44.45 E11.14 C9.1 66.04,64.77 68.58,68.58 68.58,80.01 E9.14 | E9.14 R6.2 | E9.14 C10.1 69.85,88.9 63.5,95.25 63.5,107.95 E10.14 | C12.1 43.18,81.28 E13.14 | E7.14 82.55,48.26 C7.1
  Bottom 0.813: E19.14 8.89,110.49 C18.1 7.62,116.84 26.67,116.84 C15.1 E15.14 | U$5.BA2 58.02,8.49 58.42,8.89 58.42,17.78 60.96,20.32 C21.+ | C12.1 E14.14 | R13.2 R12.2 | E13.14 C13.1 | E13.14 R14.2 | E13.14 39.37,85.09 36.83,86.36 31.75,83.82 E16.14 | C14.1 E17.14 | C17.1 60.96,114.3 64.77,110.49 E10.14 | C9.1 67.31,49.53 73.66,49.53 74.93,48.26 78.74,50.8 C7.1
AC1  (via drill 0.81)
  Top 0.406: U$5.AC1 121.92,8.89 121.92,16.51 123.19,17.78 127,17.78 130.81,21.59 130.81,38.1 E1.13 | E5.11 106.68,72.39 106.68,58.42 v114.3,50.8
  Bottom 0.406: E12.6 55.88,87.63 57.15,87.63 59.69,88.9 64.77,92.71 81.28,92.71 81.28,91.44 | 81.28,91.44 81.28,86.36 82.55,85.09 93.98,78.74 E5.3 | E5.11 105.41,78.74 105.41,83.82 102.87,86.36 100.33,86.36 96.52,90.17 93.98,91.44 81.28,91.44 | 106.68,41.91 E4.13 | 106.68,41.91 106.68,43.18 107.95,44.45 109.22,44.45 113.03,46.99 v114.3,50.8 115.57,52.07 118.11,52.07 120.65,49.53 120.65,45.72 124.46,41.91 E1.13 | 106.68,41.91 R8.1
AJ2  (via drill 0.81)
  Top 0.406: v110.49,27.94 107.95,30.48 v107.95,36.83 | E1.3 120.65,46.99 120.65,49.53 118.11,52.07 116.84,52.07 113.03,55.88 v113.03,57.15 113.03,60.96 114.3,64.77 114.3,69.85 v107.95,77.47
  Bottom 0.406: U$5.AJ2 105.41,8.89 105.41,16.51 100.33,21.59 100.33,24.13 101.6,25.4 105.41,25.4 v110.49,27.94 | E1.3 111.76,44.45 109.22,41.91 109.22,38.1 v107.95,36.83 | E4.3 99.06,48.26 99.06,49.53 101.6,52.07 106.68,52.07 v113.03,57.15
AT2  (via drill 0.81)
  Top 0.406: v52.07,50.8 52.07,58.42 v54.61,60.96 | E16.8 20.32,63.5 20.32,55.88 v24.13,52.07
  Bottom 0.406: 55.88,40.64 E11.3 | U$5.AT2 80.01,8.89 80.01,20.32 78.74,21.59 69.85,21.59 60.96,26.67 50.8,26.67 46.99,30.48 46.99,46.99 50.8,50.8 v52.07,50.8 55.88,48.26 | v54.61,60.96 48.26,55.88 36.83,55.88 34.29,58.42 33.02,58.42 30.48,55.88 30.48,53.34 29.21,52.07 v24.13,52.07 | 55.88,48.26 55.88,40.64 | 55.88,35.56 E11.5 | 55.88,35.56 E11.9 | 55.88,40.64 55.88,35.56 | 55.88,48.26 58.42,48.26 59.69,49.53 63.5,49.53 64.77,48.26 68.58,48.26 71.12,44.45 E7.3 78.74,41.91 | 78.74,41.91 78.74,39.37 77.47,36.83 | 77.47,36.83 E7.5 | 55.88,40.64 E11.11 | 77.47,36.83 E7.9 | 78.74,41.91 E7.12
BA  (via drill 0.81)
  Top 0.406: E19.4 2.54,100.33 2.54,81.28 | 2.54,81.28 2.54,60.96 v5.08,58.42 | 2.54,81.28 E18.2
  Bottom 0.406: E17.1 3.81,46.99 3.81,57.15 v5.08,58.42 5.08,63.5 E18.9
BA1  (via drill 0.81)
  Top 0.406: E10.3 52.07,101.6 52.07,99.06 53.34,97.79 53.34,88.9 54.61,87.63 54.61,71.12 v55.88,69.85 48.26,59.69 48.26,27.94 44.45,24.13 44.45,19.05 50.8,19.05 53.34,21.59 55.88,21.59 58.42,19.05 58.42,8.89 U$5.BA1
  Bottom 0.406: E13.6 40.64,68.58 40.64,67.31 43.18,64.77 48.26,64.77 v55.88,69.85
BA(0)
  Top 0.406: U$5.BS1 13.97,8.89 13.97,16.51 2.54,27.94 2.54,40.64 E17.2
BA(1)
  Bottom 0.406: U$5.BP2 20.32,8.89 20.32,16.51 21.59,17.78 21.59,21.59 20.32,22.86 16.51,22.86 15.24,24.13 15.24,33.02 E17.10
BB  (via drill 0.81)
  Top 0.406: E19.5 3.81,99.06 3.81,87.63 v5.08,86.36
  Bottom 0.406: E17.3 2.54,43.18 2.54,63.5 7.62,67.31 8.89,68.58 8.89,71.12 6.35,73.66 E18.5 3.81,73.66 2.54,74.93 2.54,85.09 3.81,86.36 v5.08,86.36
BB(0)  (via drill 0.81)
  Top 0.406: U$5.BR1 16.51,8.89 16.51,15.24 7.62,24.13 v7.62,27.94
  Bottom 0.406: v7.62,27.94 7.62,35.56 E17.4
BB(1)
  Bottom 0.406: U$5.BU2 7.62,8.89 7.62,13.97 3.81,17.78 3.81,20.32 2.54,22.86 2.54,30.48 E17.6
BC1  (via drill 0.81)
  Top 0.406: U$5.BC1 51.76,8.58 52.07,8.89 52.07,15.24 49.53,17.78 44.45,17.78 43.18,19.05 43.18,25.4 46.99,29.21 v46.99,60.96 R14.1 | E16.9 26.67,72.39 27.94,72.39 29.21,71.12 29.21,68.58 22.86,62.23 v22.86,59.69
  Bottom 0.406: v22.86,59.69 27.94,59.69 31.75,63.5 34.29,63.5 36.83,60.96 v46.99,60.96
BN1
  Top 0.406: E15.12 31.75,102.87 31.75,76.2 34.29,73.66 34.29,64.77 30.48,60.96 30.48,21.59 22.86,13.97 22.86,8.89 23.19,8.56 U$5.BN1
  Bottom 0.406: E15.12 30.48,105.41 35.56,110.49 39.37,111.76 43.18,111.76 59.69,113.03 60.96,111.76 60.96,107.95 | 60.96,107.95 E10.2 | E10.6 59.69,97.79 60.96,99.06 60.96,107.95
BV2
  Bottom 0.406: E13.5 33.02,71.12 26.67,66.04 25.4,66.04 E16.6
CLOCK1  (via drill 0.81)
  Top 0.406: E15.11 30.48,101.6 30.48,93.98 29.21,92.71 29.21,76.2 31.75,73.66 31.75,64.77 27.94,60.96 v27.94,54.61 27.94,26.67 20.32,19.05 v17.78,19.05 | v127,63.5 128.27,64.77 128.27,72.39 E2.10
  Bottom 0.406: U$5.BS2 13.97,8.89 13.97,16.51 v17.78,19.05 | v27.94,54.61 31.75,59.69 34.29,59.69 36.83,58.42 48.26,57.15 53.34,63.5 58.42,63.5 66.04,57.15 68.58,55.88 69.85,55.88 73.66,58.42 83.82,58.42 91.44,57.15 107.95,60.96 109.22,60.96 114.3,63.5 v127,63.5
CLR_FLAG  (via drill 0.81)
  Top 0.406: E8.6 v82.55,90.17
  Bottom 0.406: E5.13 101.6,81.28 96.52,86.36 93.98,86.36 87.63,88.9 v82.55,90.17
ENABLE
  Top 0.406: E16.13 27.94,83.82 27.94,96.52 E15.9
FEED_HOLE
  Bottom 0.406: U$5.BM2 26.67,8.89 26.67,20.32 R11.1
FEED_SWITCH  (via drill 0.81)
  Top 0.406: U$5.BM1 26.34,8.56 26.67,8.89 26.67,16.51 31.75,21.59 31.75,52.07 34.29,54.61 34.29,62.23 36.83,64.77 v36.83,66.04 | E10.4 R2.1 54.61,99.06 54.61,88.9 55.88,87.63 55.88,72.39 57.15,71.12 v57.15,67.31
  Bottom 0.406: v57.15,67.31 53.34,66.04 48.26,63.5 41.91,63.5 v36.83,66.04
GND  (via drill 0.81)
  Top 0.813: C18.2 7.62,109.22 7.62,97.79 E19.7 5.08,88.9 6.35,87.63 6.35,85.09 7.62,83.82 7.62,71.12 E18.7 5.08,62.23 6.35,60.96 6.35,57.15 5.08,55.88 C14.2 7.62,46.99 7.62,33.02 E17.7 | C21.- v52.07,22.86 55.88,26.67 55.88,31.75 | C24.2 D2.A R5.1 80.01,55.88 C7.2 76.2,49.53 76.2,34.29 E7.7 | E3.7 C23.2 C2.2 121.92,86.36 121.92,68.58 | 121.92,68.58 E2.7 | 121.92,68.58 121.92,67.31 119.38,64.77 C1.2 121.92,50.8 121.92,31.75 | v25.4,111.76 E15.2 | v5.08,22.86 10.16,17.78 10.16,8.89 U$5.BT1 | E15.7 21.59,72.39 E16.7 | E8.9 78.74,101.6 78.74,107.95 77.47,109.22 77.47,111.76 C8.2 | 60.96,95.25 64.77,91.44 C10.2 67.31,86.36 67.31,71.12 E9.7 64.77,67.31 62.23,64.77 62.23,55.88 58.42,52.07 C9.2 55.88,48.26 55.88,31.75 | 60.96,95.25 E10.7 | 97.79,81.28 97.79,86.36 C5.2 91.44,92.71 E6.7 93.98,97.79 93.98,110.49 C6.2 | 97.79,81.28 97.79,68.58 | 97.79,81.28 E5.2 | 40.64,87.63 C13.2 | 40.64,68.58 40.64,87.63 | E13.7 40.64,68.58 | 40.64,87.63 40.64,93.98 E12.7 44.45,97.79 44.45,111.76 C11.2 v35.56,114.3 | 60.96,95.25 60.96,109.22 C17.2 | C12.2 40.64,55.88 40.64,68.58 | U$5.AT1 80.01,8.89 80.01,19.05 68.58,30.48 v68.58,36.83 | 55.88,31.75 E11.7 | 97.79,68.58 E5.7 | 97.79,68.58 97.79,62.23 | 97.79,62.23 C4.2 | C20.- 97.79,27.94 E4.8 91.44,34.29 90.17,43.18 91.44,57.15 93.98,60.96 97.79,62.23 | v123.19,19.05 123.19,20.32 125.73,24.13 125.73,27.94 121.92,31.75 | 121.92,31.75 E1.8
  Bottom 0.813: E3.7 102.87,99.06 102.87,114.3 | 102.87,114.3 C3.2 | C6.2 102.87,114.3 | U$5.AC2 121.59,8.56 121.92,8.89 121.92,16.51 v123.19,19.05 | U$5.BC2 51.74,8.56 52.07,8.89 v52.07,22.86 | C12.2 38.1,48.26 38.1,31.75 | 38.1,31.75 E14.7 | C21.- 38.1,29.21 38.1,31.75 | E8.7 E8.9 E6.7 | E13.7 34.29,68.58 29.21,66.04 C16.- E16.7 R10.1 | C18.2 C15.2 22.86,114.3 v25.4,111.76 | E15.7 24.13,97.79 24.13,105.41 E15.2 | E9.7 67.31,68.58 73.66,64.77 77.47,67.31 R5.1 | E2.7 R4.1 | v5.08,22.86 E17.7 | C17.2 C8.2 | E7.7 71.12,33.02 v68.58,36.83
INT_REQUEST  (via drill 0.81)
  Top 0.406: E6.1 87.63,106.68 87.63,91.44 88.9,90.17 88.9,67.31 87.63,63.5 85.09,60.96 85.09,54.61 86.36,34.29 86.36,29.21 v95.25,20.32
  Bottom 0.406: U$5.AL2 99.06,8.89 99.06,16.51 v95.25,20.32
IOB_IN_4
  Bottom 0.406: U$5.AP2 90.17,8.89 90.17,15.24 86.36,21.59 78.74,25.4 71.12,25.4 66.04,29.21 60.96,36.83 E11.10
IOB_IN_5
  Bottom 0.406: U$5.AS2 83.82,8.89 83.82,15.24 82.55,19.05 78.74,22.86 69.85,22.86 60.96,27.94 50.8,27.94 48.26,30.48 48.26,44.45 50.8,46.99 E11.1
IOB_IN_6
  Top 0.406: U$5.AR1 86.36,8.89 86.36,16.51 85.09,21.59 81.28,26.67 73.66,29.21 71.12,31.75 71.12,36.83 E7.4
IOB_IN_7
  Bottom 0.406: U$5.AN2 92.71,8.89 92.71,16.51 88.9,22.86 78.74,26.67 72.39,26.67 68.58,29.21 66.04,31.75 63.5,35.56 62.23,41.91 60.96,44.45 E11.13
IOB_IN_8
  Top 0.406: U$5.AS1 83.82,8.89 83.82,17.78 82.55,21.59 80.01,24.13 74.93,26.67 69.85,31.75 69.85,41.91 E7.1
IOB_IN_9
  Top 0.406: U$5.AP1 90.17,10.16 90.17,17.78 86.36,24.13 78.74,31.75 78.74,41.91 E7.13
IOB_IN_10
  Bottom 0.406: U$5.AR2 86.36,8.89 86.36,16.51 83.82,20.32 78.74,24.13 71.12,24.13 62.23,29.21 52.07,29.21 49.53,31.75 49.53,38.1 50.8,39.37 E11.4
IOB_IN_11
  Top 0.406: U$5.AN1 92.71,8.89 92.71,16.51 83.82,29.21 83.82,34.29 E7.10
IOP1  (via drill 0.81)
  Top 0.406: v77.47,19.05 67.31,29.21 67.31,38.1 68.58,40.64 69.85,45.72 v69.85,63.5 | E9.1 62.23,81.28 v62.23,73.66
  Bottom 0.406: U$5.AU2 77.47,8.89 v77.47,19.05 | v62.23,73.66 62.23,68.58 64.77,66.04 67.31,66.04 v69.85,63.5
IOP2  (via drill 0.81)
  Top 0.406: v74.93,19.05 66.04,27.94 66.04,39.37 67.31,41.91 67.31,64.77 69.85,67.31 69.85,76.2 E9.12
  Bottom 0.406: U$5.AV2 73.66,8.89 73.66,17.78 v74.93,19.05
IOP4  (via drill 0.81)
  Top 0.406: U$5.BK1 32.72,8.59 33.02,8.89 v33.02,19.05 | E9.5 63.5,72.39 63.5,68.58 60.96,66.04 60.96,57.15 v59.69,55.88
  Bottom 0.406: v33.02,19.05 29.21,26.67 29.21,40.64 34.29,50.8 34.29,52.07 35.56,53.34 48.26,53.34 54.61,57.15 58.42,57.15 v59.69,55.88
IOT_011  (via drill 0.81)
  Top 0.406: E6.6 90.17,96.52 90.17,91.44 91.44,90.17 91.44,67.31 v90.17,62.23 87.63,59.69 87.63,48.26 88.9,30.48 92.71,26.67 v97.79,24.13 | v49.53,73.66 E13.12
  Bottom 0.406: U$5.AM2 96.52,8.89 96.52,13.97 92.71,19.05 92.71,21.59 v97.79,24.13 | v90.17,62.23 72.39,62.23 69.85,60.96 62.23,66.04 59.69,71.12 58.42,72.39 54.61,74.93 50.8,74.93 v49.53,73.66
MB3(0)
  Top 0.406: E14.11 E14.12
  Bottom 0.406: U$5.BD2 48.56,8.59 48.26,8.89 48.26,21.59 40.64,30.48 40.64,36.83 E14.11
MB4(0)
  Top 0.406: E14.4 E14.3
  Bottom 0.406: E14.4 33.02,36.83 33.02,30.48 45.72,16.51 45.72,8.89 45.39,8.56 U$5.BE2
MB5(0)
  Top 0.406: U$5.BE1 45.39,8.56 45.72,8.89 45.72,13.97 39.37,20.32 39.37,33.02 E14.5
MB6(0)
  Bottom 0.406: E14.2 31.75,40.64 31.75,30.48 41.91,19.05 41.91,8.89 42.19,8.61 U$5.BF2
MB7(0)
  Top 0.406: U$5.BF1 42.19,8.61 41.91,8.89 41.91,16.51 38.1,20.32 38.1,31.75 E14.6
MB8(1)
  Bottom 0.406: E14.1 30.48,40.64 30.48,29.21 39.37,19.05 39.37,8.89 39.04,8.56 U$5.BH2
N$1
  Top 0.406: D1.C 123.19,110.49 120.65,107.95 E3.13
N$2  (via drill 0.81)
  Top 0.406: E11.8 63.5,35.56 v63.5,43.18
  Bottom 0.406: E1.10 124.46,34.29 120.65,29.21 107.95,29.21 104.14,26.67 100.33,26.67 96.52,25.4 88.9,25.4 77.47,27.94 72.39,27.94 67.31,31.75 64.77,36.83 v63.5,43.18
N$3  (via drill 0.81)
  Top 0.406: E11.2 54.61,46.99 54.61,49.53 55.88,50.8 55.88,52.07 58.42,54.61 58.42,58.42 v59.69,59.69 | v120.65,60.96 120.65,54.61 123.19,52.07 123.19,34.29 E1.9
  Bottom 0.406: v59.69,59.69 64.77,55.88 68.58,54.61 71.12,54.61 74.93,57.15 83.82,57.15 90.17,55.88 92.71,55.88 96.52,57.15 106.68,57.15 114.3,62.23 119.38,62.23 v120.65,60.96
N$4
  Bottom 0.406: R1.1 D1.A 121.92,104.14 119.38,101.6 C22.+
N$5
  Top 0.406: E13.9 46.99,69.85 46.99,67.31 44.45,64.77 44.45,49.53 40.64,46.99 40.64,34.29 E14.8
N$6  (via drill 0.81)
  Top 0.406: E2.11 128.27,77.47 128.27,90.17 v127,91.44
  Bottom 0.406: v127,91.44 128.27,92.71 128.27,115.57 125.73,118.11 91.44,118.11 86.36,113.03 80.01,113.03 E8.1
N$8
  Bottom 0.406: 67.31,81.28 E9.2 | 67.31,81.28 E9.13 | 67.31,81.28 67.31,77.47 66.04,76.2 E9.4 49.53,76.2 48.26,74.93 48.26,69.85 46.99,68.58 E13.8
N$9
  Bottom 0.406: E7.6 74.93,34.29 80.01,30.48 83.82,29.21 101.6,29.21 109.22,33.02 E1.7
N$10  (via drill 0.81)
  Top 0.406: E11.12 v63.5,46.99
  Bottom 0.406: E1.6 119.38,36.83 121.92,34.29 121.92,33.02 119.38,30.48 107.95,30.48 101.6,27.94 95.25,26.67 88.9,26.67 78.74,29.21 72.39,29.21 67.31,34.29 66.04,36.83 66.04,44.45 v63.5,46.99
N$11  (via drill 0.81)
  Top 0.406: E4.7 92.71,36.83 v92.71,52.07
  Bottom 0.406: E7.2 74.93,44.45 80.01,49.53 88.9,49.53 v92.71,52.07
N$12
  Bottom 0.406: E4.6 86.36,39.37 E7.11
N$13  (via drill 0.81)
  Top 0.406: E11.6 49.53,35.56 49.53,46.99 50.8,48.26 53.34,49.53 v54.61,52.07 | v95.25,53.34 100.33,48.26 100.33,34.29 E4.9
  Bottom 0.406: v54.61,52.07 57.15,53.34 64.77,53.34 68.58,50.8 71.12,50.8 74.93,53.34 v95.25,53.34
N$14
  Bottom 0.406: E4.10 101.6,34.29 97.79,30.48 90.17,30.48 86.36,31.75 E7.8
N$16
  Bottom 0.406: E2.12 128.27,77.47 128.27,69.85 E2.8
N$17
  Bottom 0.406: R12.1 Q1.2 Q2.3 E17.13
N$18
  Bottom 0.406: R13.1 Q1.3
N$19
  Top 0.406: Q1.1 Q2.1
  Bottom 0.406: R10.2 20.32,45.72 Q2.1
N$20
  Top 0.406: R9.2 19.05,55.88 20.32,54.61 Q2.2
N$21  (via drill 0.81)
  Top 0.406: R16.1 124.46,95.25 120.65,91.44 113.03,91.44 111.76,92.71 111.76,102.87 E3.2 E3.1 105.41,111.76 105.41,115.57 102.87,118.11 20.32,118.11 17.78,115.57 17.78,105.41 E19.10 10.16,97.79 10.16,90.17 v11.43,88.9 | v6.35,90.17 7.62,88.9 7.62,86.36 8.89,85.09 8.89,63.5 R15.1
  Bottom 0.406: E3.1 E3.2 | E17.12 11.43,40.64 8.89,43.18 8.89,50.8 10.16,52.07 10.16,58.42 R15.1 | v6.35,90.17 v11.43,88.9
N$22
  Bottom 0.406: R9.1 24.13,48.26 C16.+ 26.67,46.99 21.59,40.64 R11.2
N$24  (via drill 0.81)
  Top 0.406: v16.51,85.09 15.24,86.36 15.24,93.98 v16.51,95.25
  Bottom 0.406: E16.5 19.05,73.66 20.32,74.93 20.32,83.82 19.05,85.09 v16.51,85.09 | E19.6 11.43,92.71 13.97,92.71 v16.51,95.25
N$25
  Top 0.406: E16.4 E16.3
N$26  (via drill 0.81)
  Top 0.406: v35.56,87.63 R3.1
  Bottom 0.406: E16.11 24.13,76.2 22.86,77.47 22.86,83.82 25.4,86.36 v35.56,87.63
N$27
  Top 0.406: E17.9 15.24,35.56 15.24,50.8 13.97,52.07 13.97,63.5 16.51,66.04 19.05,66.04 22.86,69.85 22.86,96.52 E15.6
N$28  (via drill 0.81)
  Top 0.406: v59.69,92.71 58.42,91.44 58.42,87.63 v59.69,86.36
  Bottom 0.406: E15.10 31.75,102.87 35.56,102.87 38.1,100.33 38.1,96.52 41.91,92.71 46.99,92.71 50.8,90.17 54.61,86.36 v59.69,86.36 | E10.12 63.5,102.87 63.5,96.52 v59.69,92.71
N$29
  Top 0.406: E9.8 R6.1
  Bottom 0.406: C19.2 78.74,80.01 77.47,78.74 R6.1 C24.1
N$30
  Top 0.406: D2.C R5.2 80.01,80.01 C19.1
  Bottom 0.406: E2.2 104.14,66.04 95.25,66.04 86.36,74.93 D2.C
N$32
  Bottom 0.406: E13.3 E13.2
N$33
  Bottom 0.406: E10.8 E8.5
N$34
  Top 0.406: E6.11 104.14,97.79 104.14,92.71 106.68,90.17 106.68,86.36 107.95,85.09 114.3,85.09 116.84,82.55 116.84,78.74 E2.4
  Bottom 0.406: E3.8 119.38,92.71 121.92,90.17 121.92,77.47 120.65,76.2 E2.4
N$35  (via drill 0.81)
  Top 0.406: E8.11 86.36,99.06 86.36,91.44 87.63,90.17 87.63,69.85 v86.36,68.58
  Bottom 0.406: 124.46,71.12 E2.6 | 124.46,71.12 E2.9 | 124.46,71.12 121.92,67.31 120.65,66.04 107.95,66.04 104.14,63.5 91.44,63.5 v86.36,68.58
N$36
  Top 0.406: E12.9 E12.10 | E12.12 E12.13 53.34,107.95 62.23,115.57 67.31,115.57 71.12,111.76 71.12,106.68 E8.4
  Bottom 0.406: E12.12 48.26,105.41 46.99,104.14 46.99,101.6 48.26,100.33 E12.10
N$37
  Bottom 0.406: E3.11 119.38,107.95 C22.- 119.38,111.76 115.57,116.84 97.79,116.84 96.52,115.57 96.52,114.3 97.79,113.03 99.06,113.03 100.33,111.76 100.33,109.22 E6.13
N$38
  Top 0.406: E6.12 101.6,107.95 101.6,114.3 100.33,115.57 90.17,115.57 E8.12
N$39  (via drill 0.81)
  Top 0.406: E12.2 E12.1 | E12.4 E12.5
  Bottom 0.406: R3.2 v35.56,107.95 E12.2 43.18,107.95 44.45,106.68 44.45,104.14 43.18,102.87 E12.4
N$40
  Top 0.406: E19.9 19.05,104.14 19.05,115.57 20.32,116.84 76.2,116.84 78.74,114.3 78.74,111.76 E8.13
  Bottom 0.406: E19.11 11.43,102.87 10.16,101.6 10.16,99.06 11.43,97.79 E19.9
N$41
  Bottom 0.406: E19.12 11.43,105.41 8.89,102.87 8.89,97.79 11.43,95.25 E19.8
OFFLINE  (via drill 0.81)
  Top 0.406: C23.1 R4.2 116.84,73.66 | 116.84,73.66 E2.5 | v115.57,59.69 116.84,73.66 | U$5.BU1 7.62,8.89 7.62,17.78 v6.35,19.05 | v10.16,25.4 12.7,22.86 21.59,22.86 25.4,26.67 v25.4,29.21
  Bottom 0.406: R4.2 C23.1 | v6.35,19.05 v10.16,25.4 | v25.4,29.21 27.94,35.56 27.94,40.64 33.02,50.8 33.02,53.34 34.29,54.61 48.26,54.61 54.61,58.42 59.69,58.42 64.77,54.61 67.31,53.34 72.39,53.34 74.93,55.88 82.55,55.88 86.36,54.61 106.68,55.88 114.3,59.69 v115.57,59.69
OUT_OF_TAPE  (via drill 0.81)
  Top 0.406: E6.10 102.87,96.52 102.87,91.44 105.41,88.9 105.41,76.2 107.95,72.39 v107.95,62.23
  Bottom 0.406: U$5.BL2 29.21,8.89 29.21,20.32 21.59,27.94 21.59,30.48 25.4,36.83 25.4,41.91 27.94,45.72 27.94,49.53 26.67,50.8 22.86,50.8 21.59,52.07 21.59,53.34 22.86,54.61 25.4,54.61 31.75,60.96 34.29,60.96 36.83,59.69 48.26,59.69 53.34,64.77 58.42,64.77 68.58,58.42 69.85,58.42 72.39,59.69 83.82,59.69 90.17,58.42 96.52,60.96 104.14,60.96 v107.95,62.23
PWR
  Bottom 0.406: U$5.BR2 16.51,8.89 16.51,15.24 20.32,19.05 20.32,20.32 19.05,21.59 15.24,21.59 13.97,22.86 13.97,29.21 E17.8
RD_HOLE_1  (via drill 0.81)
  Top 0.406: E4.14 105.41,41.91 105.41,29.21 110.49,24.13 116.84,24.13 v119.38,21.59
  Bottom 0.406: U$5.AD2 118.42,8.59 118.11,8.89 118.11,17.78 v119.38,21.59
RD_HOLE_2
  Top 0.406: U$5.AD1 118.11,8.89 118.11,17.78 120.65,20.32 120.65,22.86 118.11,25.4 113.03,25.4 111.76,26.67 111.76,30.48 109.22,34.29 109.22,44.45 106.68,46.99 E4.15
RD_HOLE_3  (via drill 0.81)
  Top 0.406: E4.2 97.79,44.45 97.79,31.75 109.22,21.59 113.03,21.59 v115.57,19.05
  Bottom 0.406: U$5.AE2 115.24,8.56 115.57,8.89 v115.57,19.05
RD_HOLE_4
  Top 0.406: U$5.AE1 115.57,10.16 115.57,16.51 116.84,17.78 116.84,20.32 114.3,22.86 109.22,22.86 99.06,31.75 99.06,45.72 E4.1
RD_HOLE_5  (via drill 0.81)
  Top 0.406: E1.2 115.57,44.45 115.57,31.75 120.65,26.67 v121.92,26.67
  Bottom 0.406: U$5.AH2 109.22,8.89 109.22,21.59 116.84,26.67 v121.92,26.67
RD_HOLE_6  (via drill 0.81)
  Top 0.406: U$5.AH1 109.22,8.89 109.22,15.24 v102.87,21.59 | E1.1 114.3,45.72 v114.3,27.94
  Bottom 0.406: v102.87,21.59 105.41,24.13 109.22,24.13 v114.3,27.94
RD_HOLE_7
  Bottom 0.406: U$5.AF2 112.04,8.61 111.76,8.89 111.76,15.24 114.3,21.59 118.11,24.13 125.73,24.13 128.27,26.67 128.27,44.45 E1.15
RD_HOLE_8  (via drill 0.81)
  Top 0.406: U$5.AF1 111.76,8.89 v111.76,19.05
  Bottom 0.406: v111.76,19.05 111.76,21.59 116.84,25.4 124.46,25.4 127,27.94 127,43.18 E1.14
RDR_FLAG
  Bottom 0.406: 93.98,100.33 93.98,106.68 92.71,107.95 E6.2 E6.3 | 93.98,100.33 E6.5 | 93.98,100.33 93.98,99.06 97.79,93.98 110.49,91.44 114.3,90.17 114.3,78.74 107.95,72.39 E5.9
RDR_RUN
  Bottom 0.406: E5.5 E5.12
SHIFT  (via drill 0.81)
  Top 0.406: U$5.BJ1 35.56,8.89 35.56,19.05 33.02,21.59 33.02,52.07 35.56,54.61 35.56,60.96 v38.1,63.5
  Bottom 0.406: E18.3 E18.11 13.97,74.93 13.97,59.69 15.24,58.42 19.05,58.42 21.59,60.96 26.67,60.96 30.48,64.77 34.29,64.77 35.56,63.5 v38.1,63.5
SKIP  (via drill 0.81)
  Top 0.406: v99.06,20.32 92.71,24.13 87.63,29.21 86.36,49.53 86.36,60.96 88.9,63.5 90.17,67.31 90.17,90.17 88.9,91.44 88.9,100.33 E6.4
  Bottom 0.406: U$5.AK2 102.87,8.89 102.87,13.97 v99.06,20.32
STOP_COMPLETE  (via drill 0.81)
  Top 0.406: v30.48,91.44 30.48,76.2 33.02,73.66 33.02,64.77 29.21,60.96 29.21,22.86 v25.4,19.05
  Bottom 0.406: E10.13 67.31,107.95 68.58,109.22 68.58,111.76 67.31,113.03 64.77,113.03 60.96,116.84 40.64,116.84 36.83,113.03 31.75,113.03 30.48,114.3 30.48,115.57 27.94,118.11 6.35,118.11 2.54,114.3 2.54,93.98 3.81,92.71 8.89,92.71 11.43,91.44 v30.48,91.44 | U$5.BN2 22.86,8.89 22.86,15.24 v25.4,19.05
STOP_DELAY  (via drill 0.81)
  Top 0.406: U$5.BV1 3.81,8.89 3.81,19.05 1.27,21.59 1.27,113.03 3.81,115.57 13.97,115.57 15.24,114.3 v15.24,105.41
  Bottom 0.406: v15.24,105.41 E15.3

### Text on the board
Top: + | + | + | +
Bottom: S | M7050C | CONTROL | READER